# EAGLE design Stage2_Amplifier (EAGLE 9.6.2)
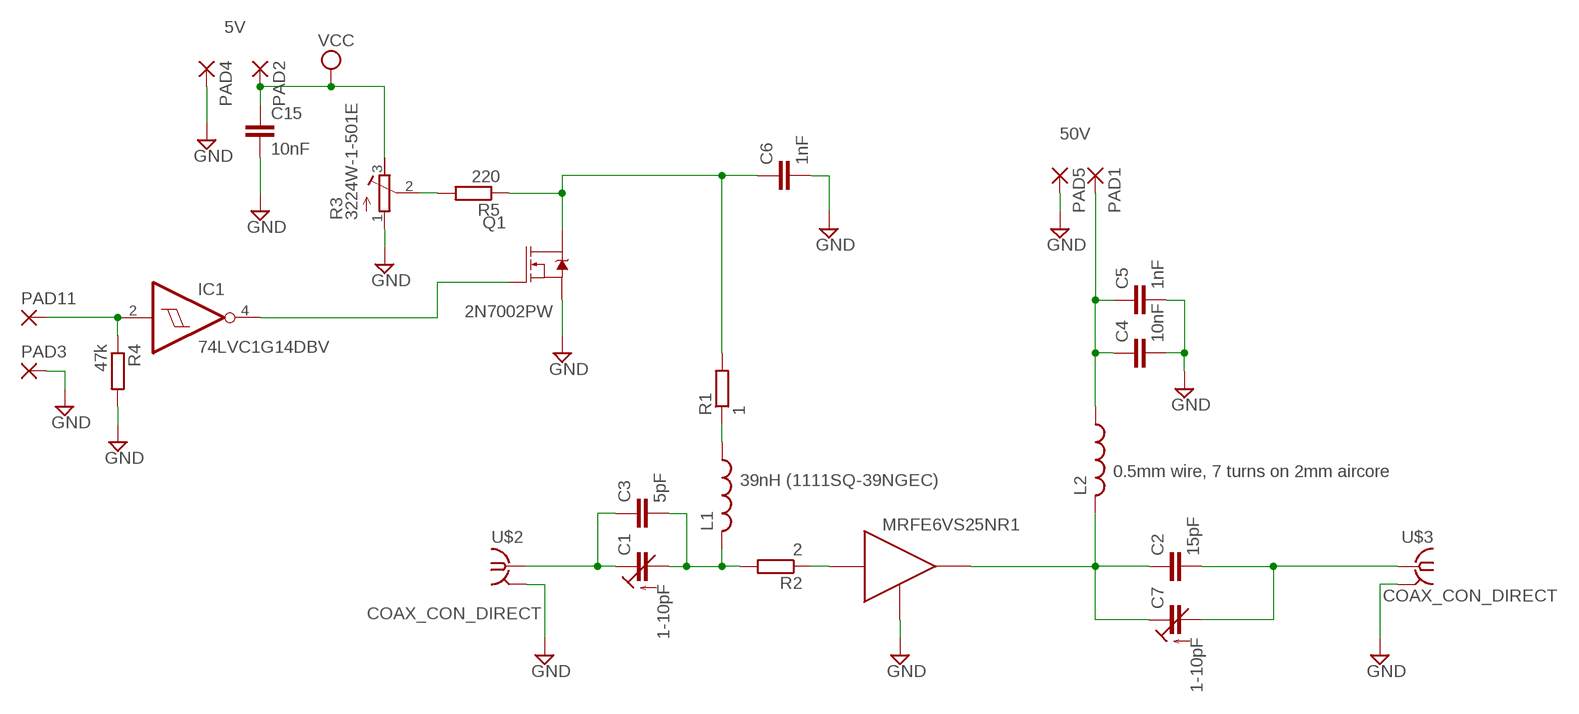
[diagram p0: schematic, sheet 1]

## Parts
C1  1-10pF  C-TRIMMTZBX4  [CTRIMTZBX4]
C2  15pF  C-EUC1210  [C1210]
C3  5pF  C-EUC1210  [C1210]
C4  10nF  C-EUC1206  [C1206]
C5  1nF  C-EUC1206  [C1206]
C6  1nF  C-EUC0805  [C0805]
C7  1-10pF  C-TRIMMTZBX4  [CTRIMTZBX4]
C15  10nF  C-EUC0805  [C0805]
IC1  74LVC1G14DBV  [SOT23-5]
L1  39nH (1111SQ-39NGEC)  L-USL3225P  [L3225P]
L2  L-USL3225P  [L3225P]
PAD1  SMD5  [SMD2,54-5,08]
PAD2  SMD5  [SMD2,54-5,08]
PAD3  SMD5  [SMD2,54-5,08]
PAD4  SMD5  [SMD2,54-5,08]
PAD5  SMD5  [SMD2,54-5,08]
PAD11  SMD5  [SMD2,54-5,08]
Q1  2N7002PW  MOSFET-NCH-2N7002PW  [SOT323]
R1  1  R-EU_R1206  [R1206]
R2  2  R-EU_R1206  [R1206]
R3  3224W-1-501E  R-TRIMM3224W  [RTRIM3224W]
R4  47k  R-EU_R0805  [R0805]
R5  220  R-EU_R0805  [R0805]
U$1  MRFE6VS25NR1  AFT05MS031_BOARD  [TO-270_ONBOARD]
U$2  COAX_CON_DIRECT  [COAX.141]
U$3  COAX_CON_DIRECT  [COAX.141]

## Nets
GND: C4.2 C5.2 C6.2 C15.2 PAD3.1(P) PAD4.1(P) PAD5.1(P) Q1.2(S) R3.1(A) R4.2 U$1.P$3(GND) U$2.P$2(GND) U$3.P$2(GND)
N$1: R2.1 U$1.P$2(IN)
N$2: C1.2(A) C3.2 L1.2 R2.2
N$3: L1.1 R1.1
N$4: C2.1 C7.1(E) L2.2 U$1.P$1(OUT)
N$5: C1.1(E) C3.1 U$2.P$1
N$6: C2.2 C7.2(A) U$3.P$1
N$7: C4.1 C5.1 L2.1 PAD1.1(P)
N$11: C6.1 Q1.3(D) R1.2 R5.1
N$15: R3.2(S) R5.2
N$18: IC1.4(O) Q1.1(G)
N$20: IC1.2(I) PAD11.1(P) R4.1
VCC: C15.1 PAD2.1(P) R3.3(E)

## Notes on the sheet
- 5V
- 50V
- 0.5mm wire, 7 turns on 2mm aircore

## Power pins joined to a net without a drawn wire
GND: IC1.3(GND)
VCC: IC1.5(VCC)

## Library data of the parts
C1 C7 = rcl:C-TRIMM: Trimm capacitor; SPICEPREFIX: C
C2-C6 C15 = rcl:C-EU: CAPACITOR, European symbol; SPICEPREFIX: C
IC1 = 74xx-little-us:74*1G14: Single Schmitt-Trigger Inverter Gate
L1 L2 = rcl:L-US: INDUCTOR, American symbol; SPICEPREFIX: L
PAD1-PAD5 PAD11 = wirepad:SMD5: SMD PAD
Q1 = SparkFun-DiscreteSemi:MOSFET-NCH: N-channel MOSFETs Voltage controlled devices that allow control of high current outputs. SparkFun Products: SparkFun OpenScale <https://www.sparkfun.com/products/13261> SparkFun Digital Sandbox <https://www.sparkfun.com/products/12651> SparkFun Monster Moto Shield <https://www.sparkfun.com/products/10182> SparkFun MOSFET Power Controller <https://www.sparkfun.com/products/11214>; PROD_ID: TRANS-11151; VALUE: 310mA/60V/1.6Ω
R1 R2 R4 R5 = rcl:R-EU_: RESISTOR, European symbol; SPICEPREFIX: R
R3 = rcl:R-TRIMM: Trimm resistor; SPICEMODEL: X; SPICEPREFIXL: POT
U$1 = Orzada:AFT05MS031_BOARD: AFT05MS031 for On Board soldering. Use Board <=1.55mm Best use Board 0.8mm
U$2 U$3 = Orzada:COAX_CON_DIRECT: Direct Coax to Bord Top

## Board
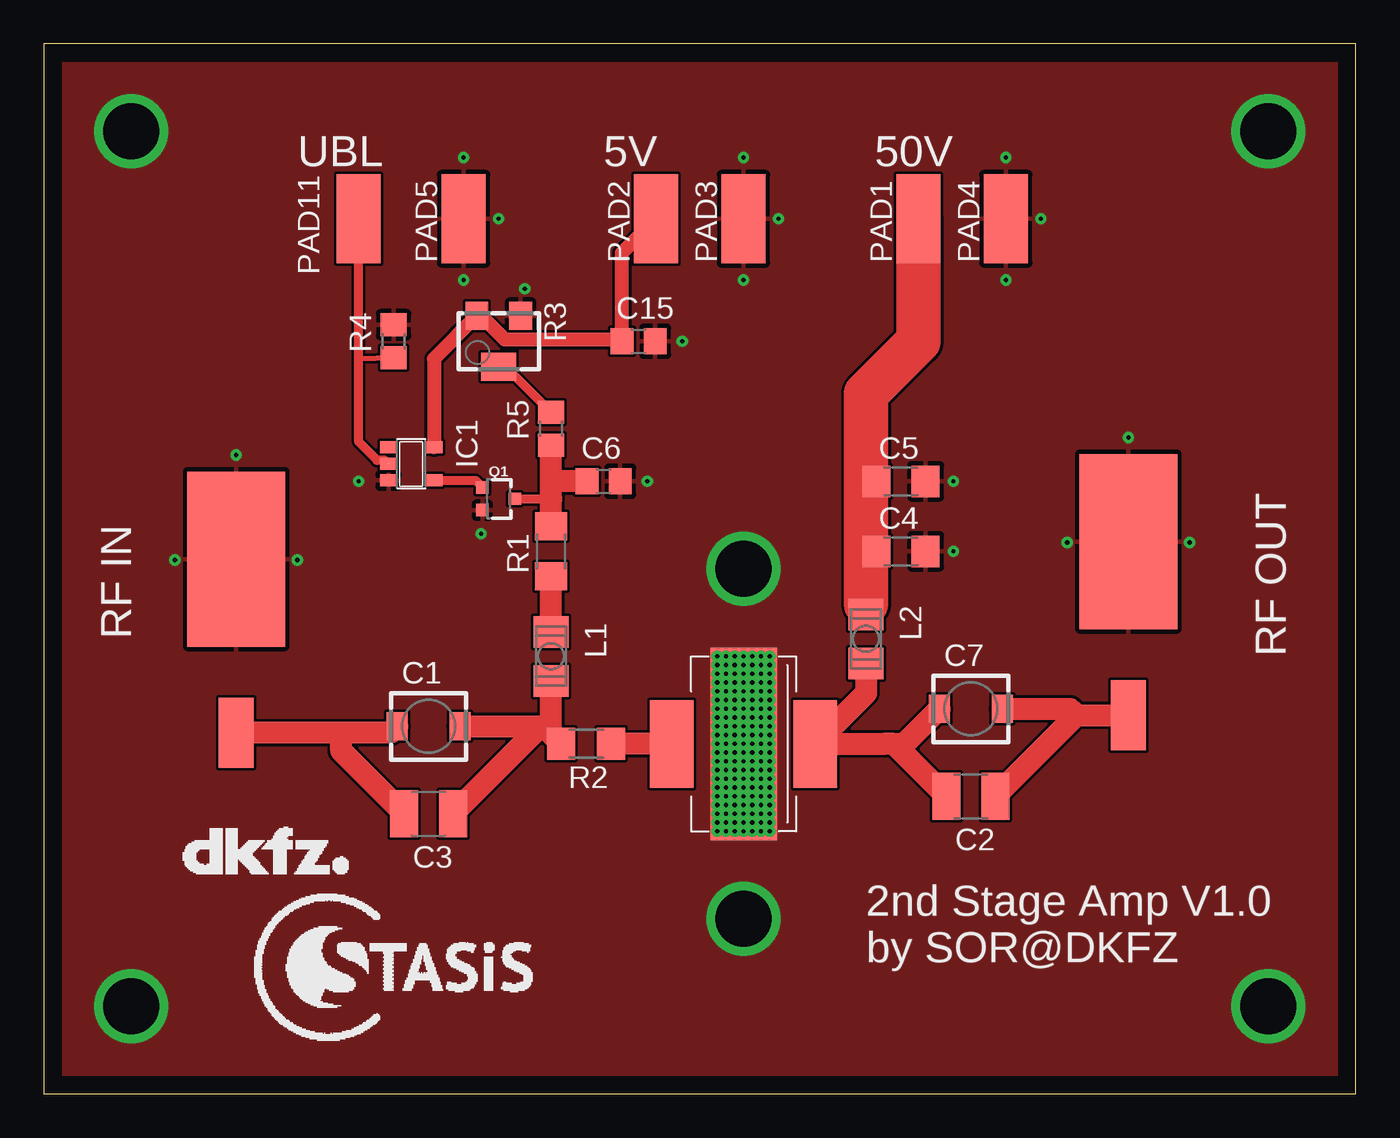
[diagram p1: board, top side]
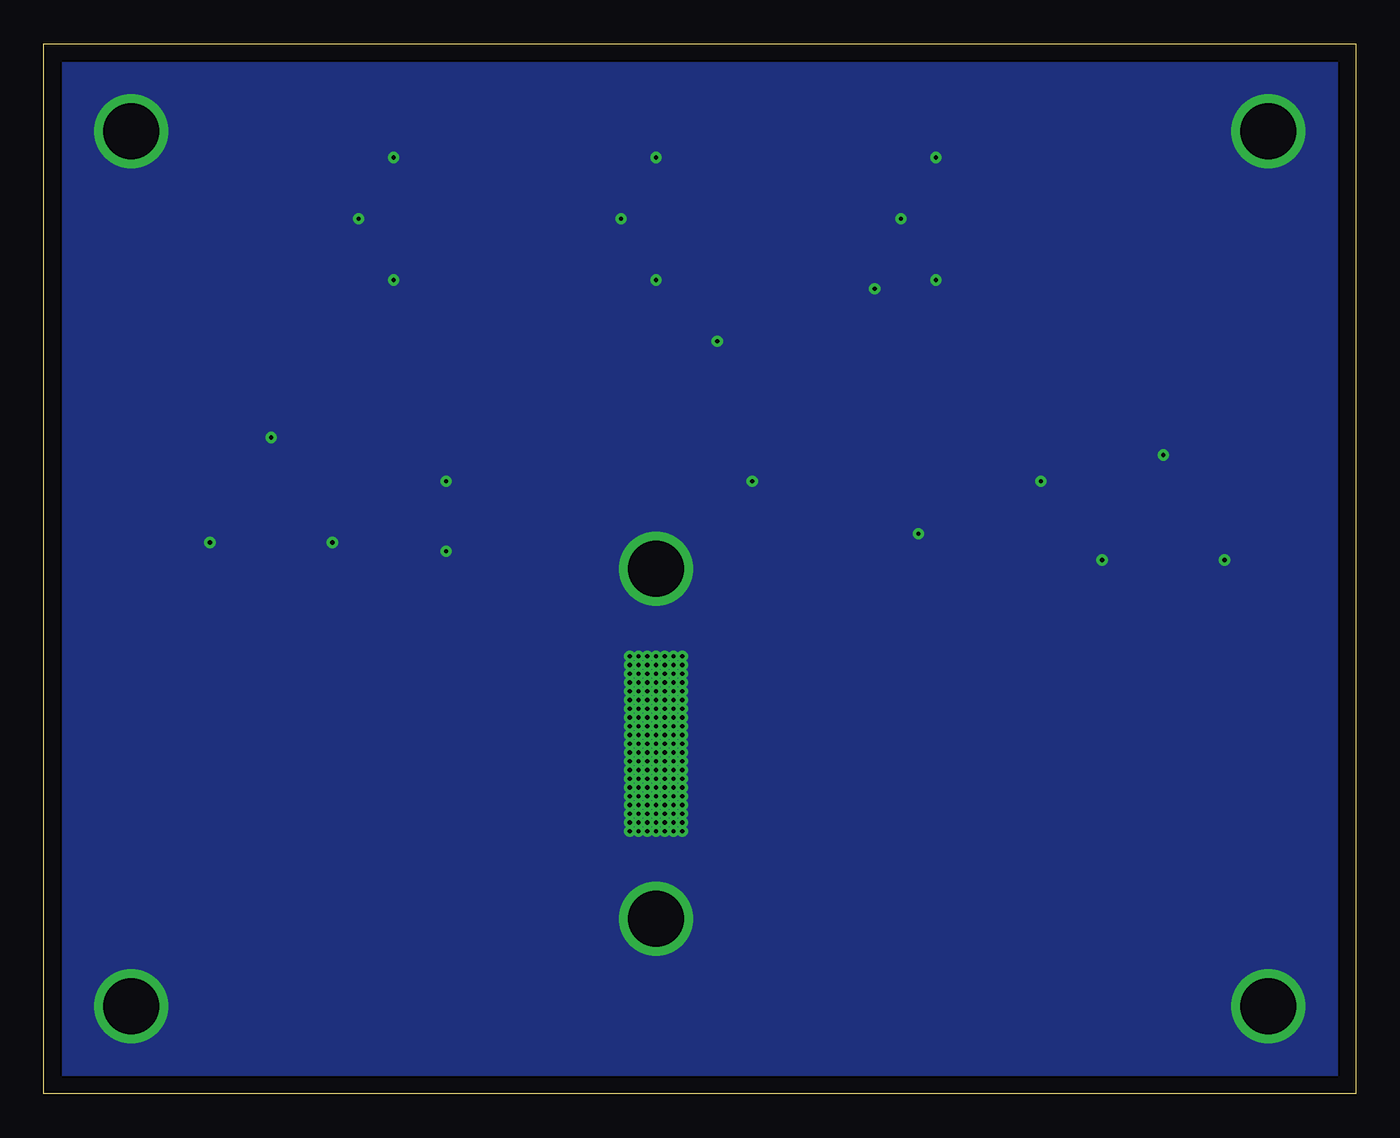
[diagram p2: board, bottom side, seen from below]

Size 75 x 60 mm. Coordinates in mm from the lower left corner, seen from the top.
Outline: 0,0 75,0 75,60 0,60 0,0
Copper layers (1*16): Top 0.035mm / dielectric 0.5mm / Bottom 0.035mm
Design rules "default *": minimum track width 6mil, minimum drill 0.2mm, track to track 6mil, track to pad 6mil, pad to pad 6mil, via to via 6mil, smd to smd 4mil, copper to edge 40mil, drill to drill 6mil, minimum pad ring 10mil, minimum via ring 8mil, stop-mask expansion 4mil, vias tented up to drill 0mil, thermal gap 10mil

### Footprints (pad centres in the part's own frame; a part is rotated, then mirrored left to right if it is on the bottom)
CTRIMTZBX4 = smd 1.6 x 1.2: 1 0,1.8; 2 0,-1.8
C1210 = smd 1.6 x 2.7: 1 -1.4,0; 2 1.4,0
C1206 = smd 1.6 x 1.8: 1 -1.4,0; 2 1.4,0
C0805 = smd 1.3 x 1.5: 1 -0.95,0; 2 0.95,0
SOT23-5 = smd 0.69 x 0.99: 1 -0.95,-1.29; 2 0,-1.29; 3 0.95,-1.29; 4 0.95,1.3; 5 -0.95,1.3
L3225P = smd 1.8 x 2: 1 -1.4,0; 2 1.4,0
SMD2,54-5,08 = smd 2.54 x 5.08: 1 0,0
SOT323 = smd 0.7 x 0.7: 1 -0.65,-0.925; 2 0.65,-0.925; 3 0,0.925
R1206 = smd 1.6 x 1.803: 1 -1.422,0; 2 1.422,0
RTRIM3224W = smd 1.3 x 1.6: 1 -1.25,-1.45; 3 1.25,-1.45 | smd 2 x 1.6: 2 0,1.45
R0805 = smd 1.3 x 1.5: 1 -0.95,0; 2 0.95,0
TO-270_ONBOARD = smd 2.5 x 5: P$1 4.1,0; P$2 -4.1,0 | smd 3.8 x 11: P$3 0,0
COAX.141 = smd 4 x 2: P$1 -3.364,0 | smd 10 x 5.588: P$2 6.546,0

### Placement (x,y rotation side)
C1  22,21 90 top
C2  53,17 0 top
C3  22,16 0 top
C4  49,31 0 top
C5  49,35 0 top
C6  32,35 0 top
C7  53,22 90 top
C15  34,43 0 top
IC1  21,36 270 top
L1  29,25 270 top
L2  47,26 270 top
PAD1  50,50 0 top
PAD2  35,50 0 top
PAD3  40,50 0 top
PAD4  55,50 0 top
PAD5  24,50 0 top
PAD11  18,50 180 top
Q1  26,34 270 top
R1  29,31 90 top
R2  31,20 180 top
R3  26,43 180 top
R4  20,43 90 top
R5  29,38 90 top
U$1  40,20 0 top
U$2  11,24 90 top
U$3  62,25 90 top
U$4  [LOGO_STASIS]  21,7 0 top
U$5  [LOGO_DKFZ]  8,12.5 0 top

### Tracks (layer width: path | path; a pad name or v marks a point on that pad's centre or on a via)
GND  (via drill 0.25, 3.2)
  other vias: 40,30 40,10 70,5 5,5 5,55 70,55 38.5,25 39,25 39.5,25 40,25 40.5,25 41,25 41.5,25 41.5,24.5 41,24.5 40.5,24.5 40,24.5 39.5,24.5 39,24.5 38.5,24.5 38.5,24 39,24 39.5,24 40,24 40.5,24 41,24 41.5,24 41.5,23.5 41,23.5 40.5,23.5 40,23.5 39.5,23.5 39,23.5 38.5,23.5 38.5,23 39,23 39.5,23 40,23 40.5,23 41,23 41.5,23 41.5,22.5 41,22.5 40.5,22.5 40,22.5 39.5,22.5 39,22.5 38.5,22.5 38.5,22 39,22 39.5,22 40,22 40.5,22 41,22 41.5,22 41.5,21.5 41,21.5 40.5,21.5 40,21.5 39.5,21.5 39,21.5 38.5,21.5 38.5,21 39,21 39.5,21 40,21 40.5,21 41,21 41.5,21 41.5,20.5 41,20.5 40.5,20.5 40,20.5 39.5,20.5 39,20.5 38.5,20.5 38.5,20 39,20 39.5,20 40,20 40.5,20 41,20 41.5,20 41.5,19.5 41,19.5 40.5,19.5 40,19.5 39.5,19.5 39,19.5 38.5,19.5 38.5,19 39,19 39.5,19 40,19 40.5,19 41,19 41.5,19 41.5,18.5 41,18.5 40.5,18.5 40,18.5 39.5,18.5 39,18.5 38.5,18.5 38.5,18 39,18 39.5,18 40,18 40.5,18 41,18 41.5,18 41.5,17.5 41,17.5 40.5,17.5 40,17.5 39.5,17.5 39,17.5 38.5,17.5 38.5,17 39,17 39.5,17 40,17 40.5,17 41,17 41.5,17 41.5,16.5 41,16.5 40.5,16.5 40,16.5 39.5,16.5 39,16.5 38.5,16.5 38.5,16 39,16 39.5,16 40,16 40.5,16 41,16 41.5,16 41.5,15.5 41,15.5 40.5,15.5 40,15.5 39.5,15.5 39,15.5 38.5,15.5 38.5,15 39,15 39.5,15 40,15 40.5,15 41,15 41.5,15 34.5,35 36.5,43 27.5,46 18,35 25,32 52,31 52,35 57,50 55,53.5 55,46.5 42,50 40,46.5 40,53.5 26,50 24,53.5 24,46.5 65.5,31.5 58.5,31.5 62,37.5 14.5,30.5 11,36.5 7.5,30.5
  pour Bottom: 1,59 1,1 74,1 74,59
  pour Top (rank 2): 1,59 1,1 74,1 74,59
  pour Top (no thermals): 37.5,26 37.5,14 42.5,14 42.5,26
N$1
  Top 1.27: U$1.P$2 R2.1
N$2
  Top 1.27: R2.2 29,20.58 | 29,20.58 L1.2 | C1.2 28.4,21 | 29,20.58 28.58,21 28.4,21 | C3.2 28.4,21
N$3
  Top 1.27: L1.1 R1.1
N$4
  Top 1.27: L2.2 47,22.9 U$1.P$1 48,20 48.6,20 | C7.1 49.2,20 48.6,20 | C2.1 48.6,20
N$5
  Top 1.27: C1.1 19.84,20.64 17,20.64 | 17,20.64 U$2.P$1 | C3.1 17,19.6 17,20.64
N$6
  Top 1.27: C2.2 59.04,21.64 | 59.04,21.64 U$3.P$1 | C7.2 58.67,22 59.04,21.64
N$7
  Top 0.203: 47,28 L2.1 | C4.1 47,31 | C5.1 47,35
  Top 2.54: PAD1.1 50,43 47,40 47,35 47,31 47,28
N$11
  Top 0.508: Q1.3 29,34
  Top 1.27: R1.2 29,34 29,35 | 29,35 R5.1 | C6.1 29,35
N$15
  Top 0.508: R5.2 26.4,41.55 R3.2
N$18
  Top 0.508: IC1.4 24.68,35.05 Q1.1
N$20
  Top 0.305: R4.1 18,42
  Top 0.508: IC1.2 19.51,36.2 19.05,36.2 18,37.24 18,42 PAD11.1
VCC
  Top 0.813: PAD2.1 33.05,48.05 C15.1 32.96,43.09 26.37,43.09 25.01,44.45 R3.3 22.3,42 IC1.5

### Text on the board
tPlace: RF IN | RF OUT
tNames: UBL | 5V | 50V | 2nd Stage Amp V1.0 / by SOR@DKFZ